# Altium schematic sheet microcontroller.SchDoc
size A
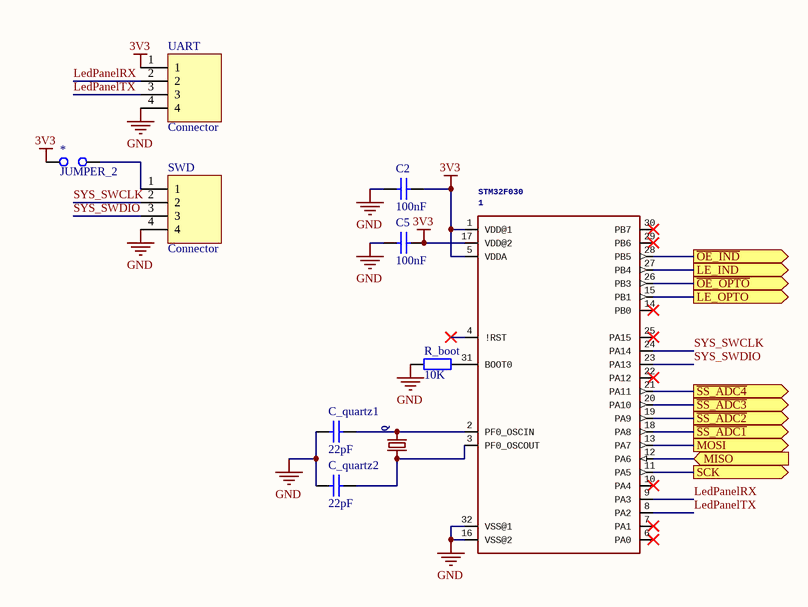
[diagram p0: microcontroller.SchDoc]

## Parts
1  STM32F030  [TQFP32-08]
*  JUMPER_2  [JUMPER_2]
C2  100nF  [FP_0805_CAP_085]
C5  100nF  [FP_0805_CAP_085]
C_quartz1  22pF  [FP_0805_CAP_085]
C_quartz2  22pF  [FP_0805_CAP_085]
Q  (no value)  [CSM-7X-DU]
R_boot  10K  [FP_0805_RES]
SWD  Connector  [FP_CONN4_TUSKE_254MM]
UART  Connector  [FP_CONN4_TUSKE_254MM]

## Ports
LE_IND (out), LE_OPTO (out), MISO (in), MOSI (out), SCK (out), ~{OE_IND} (out), ~{OE_OPTO} (out), ~{SS_ADC1} (out), ~{SS_ADC2} (out), ~{SS_ADC3} (out), ~{SS_ADC4} (out)

## Nets
3V3: 1.1(VDD@1) 1.5(VDDA) 1.17(VDD@2) *.1(C1) C2.2 C5.2 UART.1
GND: 1.16(VSS@2) 1.32(VSS@1) C2.1 C5.1 C_quartz1.1 C_quartz2.1 R_boot.1 SWD.4 UART.4
LE_IND: 1.27(PB4) ; port LE_IND
LE_OPTO: 1.15(PB1) ; port LE_OPTO
LedPanelRX: 1.9(PA3) UART.2
LedPanelTX: 1.8(PA2) UART.3
MISO: 1.12(PA6) ; port MISO
MOSI: 1.13(PA7) ; port MOSI
~{OE_IND}: 1.28(PB5) ; port ~{OE_IND}
~{OE_OPTO}: 1.26(PB3) ; port ~{OE_OPTO}
~{SS_ADC1}: 1.18(PA8) ; port ~{SS_ADC1}
~{SS_ADC2}: 1.19(PA9) ; port ~{SS_ADC2}
~{SS_ADC3}: 1.20(PA10) ; port ~{SS_ADC3}
~{SS_ADC4}: 1.21(PA11) ; port ~{SS_ADC4}
SCK: 1.11(PA5) ; port SCK
SYS_SWCLK: 1.24(PA14) SWD.2
SYS_SWDIO: 1.23(PA13) SWD.3
Net1_2: 1.2(PF0_OSCIN) C_quartz1.2 Q.2
Net1_3: 1.3(PF0_OSCOUT) C_quartz2.2 Q.1
Net1_31: 1.31(BOOT0) R_boot.2
Net*_2: *.2(C2) SWD.1

Not connected (* = marked no-connect by the designer): 1 4(!RST)* 6(PA0)* 7(PA1)* 10(PA4)* 14(PB0)* 22(PA12)* 25(PA15)* 29(PB6)* 30(PB7)*

## Library data of the parts
1 = STM32F030: GateName_1: G$1; SymbolName_1: STM32F030X; LibraryName: stm32F030x; DeviceSetName: STM32F030; Package: TQFP32-08
C2 C5 = CAP 100nF: Capacitor; Tolerance: +80%/-20%; Voltage: 25V; Reference: 1759167; Name: SMD Multilayer Ceramic Capacitor, 0805; Supplier: Farnell; Value: 100nF
C_quartz1 C_quartz2 = CAP 22pF: Capacitor; Tolerance: 5%; Voltage: 50V; Reference: 1759195; Name: SMD Multilayer Ceramic Capacitor, 0805; Supplier: Farnell; Value: 22pF
Q = CSM-7X-DU: GateName_1: P; SymbolName_1: Q; LibraryName: crystal; DeviceSetName: CSM-7X-DU; Package: CSM-7X-DU; OC_FARNELL: unknown; OC_NEWARK: unknown
R_boot = RES 10K: Resistor; Tolerance: 5%; Power: 125mW; Name: YAGEO (PHYCOMP)  RC0805JR-0710KL  SMD Chip Resistor, Thick Film, 10 kohm; Reference: 9234136; Supplier: Farnell; Value: 10K
SWD UART = Connector_4pin: 4pin Connector